# Altium schematic sheet MCU.SchDoc: MCU
size 431 x 279 mm; Organization: ORGANIZATION; Address1: ADDRESS 1; Address2: ADDRESS 2; Address3: ADDRESS 3; Address4: ADDRESS 4; Revision: -; SheetNumber: 4; SheetTotal: 8; ENG_APP_DATE: --/--/--; DSN_APP_DATE: --/--/--; CHK_APP_DATE: --/--/--
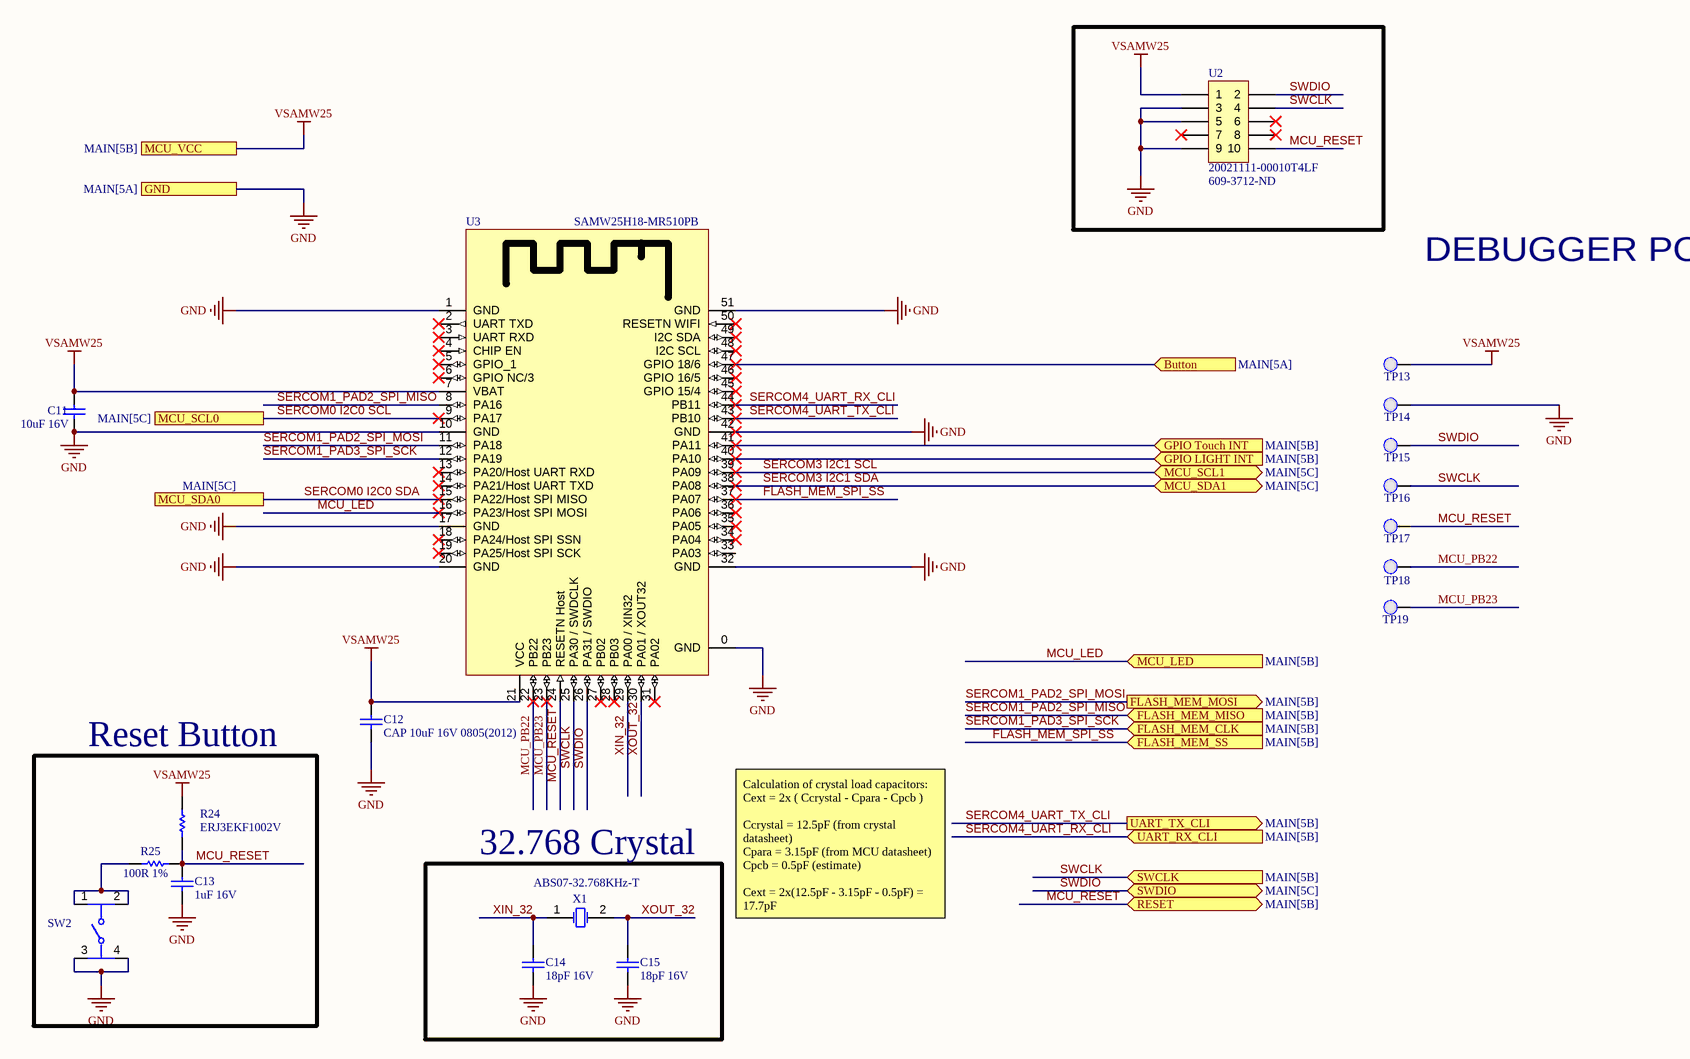
[diagram p0: MCU.SchDoc]

## Parts
C11  10uF 16V  [CAPC0805(2012)145_N]
C12  CAP 10uF 16V 0805(2012)  [CAPC0805(2012)145_N]
C13  1uF 16V  [CAPC0603(1608)100_N]
C14  18pF 16V  [CAPC0603(1608)100_N]
C15  18pF 16V  [CAPC0603(1608)100_N]
R24  ERJ3EKF1002V  [RESC1609X55X30LL15T15]
R25  100R 1%  [RESC0603(1608)_N]
SW2  PTS810 SJG 250 SMTR LFS  [FP-PTS810_SJG_250_SMTR_LF-MFG]  (value not drawn)
TP13  0.1" Pad  [PCBComponent]  (value not drawn)
TP14  0.1" Pad  [PCBComponent]  (value not drawn)
TP15  0.1" Pad  [PCBComponent]  (value not drawn)
TP16  0.1" Pad  [PCBComponent]  (value not drawn)
TP17  0.1" Pad  [PCBComponent]  (value not drawn)
TP18  0.1" Pad  [PCBComponent]  (value not drawn)
TP19  0.1" Pad  [PCBComponent]  (value not drawn)
U2  20021111-00010T4LF  Supplier Part Number 1: 609-3712-ND  [20021111-00010T4LF]
U3  SAMW25H18-MR510PB  [SAMW25H18-MR510PB]
X1  ABS07-32.768KHz-T  [ABRA-ABS07-2_V]

## Blocks framed on the sheet
Reset Button: C13 R24 R25 SW2
32.768 Crystal: C14 C15 X1

## Ports
Button (in, see MAIN[5A]), FLASH_MEM_CLK (in, see MAIN[5B]), FLASH_MEM_MISO (in, see MAIN[5B]), FLASH_MEM_MOSI (out, see MAIN[5B]), FLASH_MEM_SS (in, see MAIN[5B]), GND (see MAIN[5A]), GPIO LIGHT INT (in, see MAIN[5B]), GPIO Touch INT (in, see MAIN[5B]), MCU_LED (in, see MAIN[5B]), MCU_SCL0 (see MAIN[5C]), MCU_SCL1 (bidir, see MAIN[5C]), MCU_SDA0 (see MAIN[5C]), MCU_SDA1 (bidir, see MAIN[5C]), MCU_VCC (see MAIN[5B]), RESET (bidir, see MAIN[5B]), SWCLK (in, see MAIN[5B]), SWDIO (bidir, see MAIN[5C]), UART_RX_CLI (in, see MAIN[5B]), UART_TX_CLI (out, see MAIN[5B])

## Nets
GND: C11.1 C12.1 C13.1 C14.1 C15.1 SW2.3 SW2.4 TP14.1(PAD) U2.3 U2.5 U2.9 U3.0(GND) U3.1(GND) U3.10(GND) U3.17(GND) U3.20(GND) U3.32(GND) U3.42(GND) U3.51(GND) ; port GND
VSAMW25: C11.2 C12.2 R24.2 TP13.1(PAD) U2.1 U3.7(VBAT) U3.21(VCC) ; port MCU_VCC
Button: U3.47(GPIO_18/6) ; port Button
FLASH_MEM_SPI_SS: U3.37(PA07) ; port FLASH_MEM_SS
GPIO LIGHT INT: U3.40(PA10) ; port GPIO LIGHT INT
GPIO Touch INT: U3.41(PA11) ; port GPIO Touch INT
MCU_LED: U3.16(PA23/Host_SPI_MOSI) ; port MCU_LED
MCU_PB22: TP18.1(PAD) U3.22(PB22)
MCU_PB23: TP19.1(PAD) U3.23(PB23)
MCU_RESET: C13.2 R24.1 R25.2 TP17.1(PAD) U2.10 U3.24(RESETN_Host) ; port RESET
SERCOM0 I2C0 SCL: U3.9(PA17) ; port MCU_SCL0
SERCOM0 I2C0 SDA: U3.15(PA22/Host_SPI_MISO) ; port MCU_SDA0
SERCOM1_PAD2_SPI_MISO: U3.8(PA16) ; port FLASH_MEM_MISO
SERCOM1_PAD2_SPI_MOSI: U3.11(PA18) ; port FLASH_MEM_MOSI
SERCOM1_PAD3_SPI_SCK: U3.12(PA19) ; port FLASH_MEM_CLK
SERCOM3 I2C1 SCL: U3.39(PA09) ; port MCU_SCL1
SERCOM3 I2C1 SDA: U3.38(PA08) ; port MCU_SDA1
SERCOM4_UART_RX_CLI: U3.44(PB11) ; port UART_RX_CLI
SERCOM4_UART_TX_CLI: U3.43(PB10) ; port UART_TX_CLI
SWCLK: TP16.1(PAD) U2.4 U3.25(PA30_/_SWDCLK) ; port SWCLK
SWDIO: TP15.1(PAD) U2.2 U3.26(PA31_/_SWDIO) ; port SWDIO
XIN_32: C14.2 U3.29(PA00_/_XIN32) X1.1(X1)
XOUT_32: C15.2 U3.30(PA01_/_XOUT32) X1.2(X2)
NetR25_1: R25.1 SW2.1 SW2.2

Not connected (* = marked no-connect by the designer): U2 6* 7* 8*; U3 2(UART_TXD)* 3(UART_RXD)* 4(CHIP_EN)* 5(GPIO_1)* 6(GPIO_NC/3)* 13(PA20/Host_UART_RXD)* 14(PA21/Host_UART_TXD)* 18(PA24/Host_SPI_SSN)* 19(PA25/Host_SPI_SCK)* 27(PB02)* 28(PB03)* 31(PA02)* 33(PA03) 34(PA04)* 35(PA05)* 36(PA06)* 45(GPIO_15/4)* 46(GPIO_16/5)* 48(I2C_SCL)* 49(I2C_SDA)* 50(RESETN_WIFI)*

## Notes on the sheet
- DEBUGGER PORT
- Calculation of crystal load capacitors:
  Cext = 2x ( Ccrystal - Cpara - Cpcb )
  Ccrystal = 12.5pF (from crystal datasheet)
  Cpara = 3.15pF (from MCU datasheet)
  Cpcb = 0.5pF (estimate)
  Cext = 2x(12.5pF - 3.15pF - 0.5pF) = 17.7pF
- DWG. NO.
- REV.
- SHT.
- THIS DOCUMENT AND THE DATA DISCLOSED HEREIN OR HEREWITH IS THE PROPERTY OF ALTIUM LIMITED AND MAY BE FREELY DISTRIBUTED IN WHOLE. NO RIGHTS ARE RESERVED OR EXPRESS OR IMPLIED WARANTEE GIVEN.
- REVISION
- DESCRIPTION
- DATE
- APPROVED
- ENG:
- APPROVALS
- PROJECT
- DSN:
- CHK:
- REFERENCE DOCUMENTS
- PROJECT REVISION:
- TITLE
- DOCUMENT REVISION:
- DESIGN ITEM:
- BOM:
- FAB DWG:
- PCB DWG:
- ASSY DWG:
- SCALE:
- SIZE
- B
- CAGE CODE
- FILE NAME
- DWG NO.
- SHEET
- OF
- REV

## Library data of the parts
C11 C12 = CMP-1036-04927-1: CAP 10uF 16V ±10% 0805 (2012 Metric) Thickness 1.45mm SMD; Case-EIA: 0805; Tolerance: Â±10%; Case-Metric: 2012; Rated Voltage: 16 V; Technology: SMT; Value: 10uF; Max Thickness: 1.45 mm
C13 = CMP-1035-02736-1: CAP 1uF 16V ±5% 0603 (1608 Metric) Thickness 1mm SMD; Case-Metric: 1608; Case-EIA: 0603; Tolerance: Â±5%; Technology: SMT; Max Thickness: 1 mm; Rated Voltage: 16 V; Value: 1uF
C14 C15 = CMP-1035-00738-1: CAP 18pF 16V ±5% 0603 (1608 Metric) Thickness 1mm SMD; Tolerance: Â±5%; Case-EIA: 0603; Case-Metric: 1608; Max Thickness: 1 mm; Rated Voltage: 16 V; Value: 18pF; Technology: SMT
R24 = CMP-1012-00623-3: Chip Resistor, 10 KOhm, +/- 1%, 0.1 W, -55 to 155 degC, 0603 (1608 Metric), RoHS, Tape and Reel; Manufacturer: Panasonic; Case\/Package: 0603; Max Power Dissipation: 100mW; Resistance: 10KOhm; Temperature Coefficient: 100ppm\/degreesC; Voltage Rating (DC): 75V; Tolerance: 1%; Case Code (Imperial): 0603; Case Code (Metric): 1608; Composition: ThickFilm; Contact Plating: Tin; Datasheet URL: https://industrial.panasonic.com/cdbs/www-data/pdf/RDA0000/AOA0000C304.pdf; Datasheet Version: 02/2017; Depth: 0.8mm; Height: 0.45mm; Lead Free: LeadFree; Length: 1.6mm; Manufacturer URL: http://www.panasonic.com/; Max Operating Temperature: 155degC; Military Standard: Not; Min Operating Temperature: -55degC; Mount: SurfaceMount; Mounting Technology: SurfaceMount; Number of Pins: 2; Number of Terminations: 2; Package Description: 2-Pin Surface Mount Device, Body 1.6 x 0.85 mm; Package Quantity: 1; Package Reference: 603; Packaging: TapeandReel; Power Rating: 100mW; Radiation Hardening: No; REACH SVHC: NoSVHC; RoHSCompliant: true; Termination: SMD/SMT; Voltage Rating: 75V; Width: 0.031inch
R25 = CMP-1012-00397-1: 100R 0.1W 1% 0603 (1608 Metric)  SMD; Value: 100.00 Ohm; Case-EIA: 0603; Case-Metric: 1608; Technology: SMT; Tolerance: 1 %; Power: 0.1 W
SW2 = CMP-10040-000011-1: SWITCH TACTILE SPST-NO 0.05A 16V; Manufacturer: C&K Components; Electromechanical Life: 100000Cycles; Contact Resistance: 500mΩ; Operating Force: 400gf; Current Rating: 50mA; Voltage Rating Dc: 16V; Device Class L2: Switches; Device Class L1: Electromechanical; ComponentLink2URL: https://www.ckswitches.com/media/1476/pts810.pdf; Digikey Description: SWITCH TACTILE SPST-NO 0.05A 16V; RoHS: TRUE; Temperature Range Low: -40°C; Temperature Range High: +85°C; Automotive: No; Category: Switch; ComponentLink2Description: Datasheet; Device Class L3: Tactile Switches; Mouser Description: Switch Tactile N.O. SPST Button J-Bend 0.05A 16VDC 100000Cycles 3.92N SMD T/R; Throw Configuration: SPST-NO; Package: PTS810 SJG 250 SMTR LFS; Height: 2.7mm; Octopart: https://octopart.com/pts810sjg250smtrlfs-c%26k+components-29380277; Manufacturer Part Number: PTS810 SJG 250 SMTR LFS; Temperature: -40°C to +85°C; Lead Free: Yes
TP13-TP19 = 0.1" Pad-A.4
U2 = 20021111-00010T4LF: CONN HEADER 10POS UNSHD VERT T/H; Manufacturer: Amphenol / FCI; Stack Height: 2.5 mm; Number of Positions / Contacts: 10; Brand: FCI; Pitch: 1.27 mm; Mounting Angle: Vertical; Current Rating: 10 A; Mating Post Length: 3.05 mm; Voltage Rating: 125 V; Manufacturer Part Number: 20021111-00010T4LF; Mounting Style: Through Hole; Product Category: Headers & Wire Housings; RoHS: Details; Series: Minitek; Product Type: Headers; Type: Unshrouded; Number of Positions: 10; Number of Rows: 2; Contact Plating: Gold; Housing Material: Plastic; Termination Style: Through Hole; Contact Material: Nickel; Packaging: Tube; Factory Pack Quantity: 93; Termination Post Length: 2.3 mm; ComponentLink1URL: https://datasheet.ciiva.com/1433/1079612-1433267.pdf; ComponentLink1Description: https://datasheet.ciiva.com/1433/1079612-1433267.pdf; ComponentLink2URL: https://datasheet.ciiva.com/409/20021111-409158.pdf; ComponentLink2Description: https://datasheet.ciiva.com/409/20021111-409158.pdf; ComponentLink3URL: https://datasheet.ciiva.com/5131/20021111-5131386.pdf; ComponentLink3Description: https://datasheet.ciiva.com/5131/20021111-5131386.pdf; ComponentLink4URL: https://datasheet.ciiva.com/9465/20021111-9465402.pdf; ComponentLink4Description: https://datasheet.ciiva.com/9465/20021111-9465402.pdf; Supplier 1: Digi-Key
U3 = SAMW25H18-MR510PB: RF TXRX MODULE WIFI TRACE ANT; Manufacturer: Atmel; Manufacturer Part Number: ATSAMW25H18-MR510PB; Protocol: 802.11b/g/n; Frequency: 2.4GHz; Data Rate: 65Mbps; Power - Output: 17dBm; Sensitivity: -95.5dBm; Serial Interfaces: SPI, UART; Antenna Type: Integrated, Trace; Memory Size: 256kB Flash, 32kB SRAM; Voltage - Supply: 2.7 V ~ 4.2 V; Category: RF/IF and RFID; Family: RF Transceiver Modules; Series: Xplained Pro; Packaging: Tray; RF Family/Standard: WiFi; Modulation: -; Current - Receiving: -; Current - Transmitting: -; Mounting Type: Surface Mount; Operating Temperature: -40°C ~ 85°C; Package / Case: Module; ComponentLink1URL: http://www.atmel.com/devices/ATSAMW25.aspx; ComponentLink1Description: http://www.atmel.com/devices/ATSAMW25.aspx; ComponentLink2URL: http://www.farnell.com/datasheets/1965115.pdf; ComponentLink2Description: http://www.farnell.com/datasheets/1965115.pdf; Supplier 1: Digikey; Stock 1: 120; Pricing 1: 1=19.14 (USD); Supplier Part Number 1: ATSAMW25H18-MR510PB-ND
X1 = CMP-0447-00001-2: Crystal, 32.768 kHz, 12.5 pF, -40 to 85 degC, SMD Low Profile 3.2 x 1.5 x 0.9 mm, Tape and Reel; Manufacturer: Abracon; Q Value (Type): 30000; Operation Mode: Flexural Mode (Tuning Fork); Shunt Capacitance (C0): 0.9 to 1.2 pF; Load Capacitance (CL): 12.5 pF; Frequency Tolerance @+25degC: +/- 20 ppm; Drive Level (Type): 0.1 uW; Equivalent Series Resistance (R1): 70 Kohm; Insulation Resistance (Min): 500 Mohm; ComponentLink3URL: http://www.abracon.com/Resonators/ABS07.pdf; PackageDescription: 2-Pin Hand Drawn, Body 3.2x1.5mm, Pitch 2.5mm; Operating Temperature: -40 to 85 degC; ComponentLink2URL: http://www.abracon.com/Resonators/ABS07.pdf; PackageReference: ABS07-2; ComponentLink3Description: Package Specification; ComponentLink1Description: Manufacturer URL; DatasheetVersion: 04.03.13; Mounting Technology: Surface Mount; ComponentLink2Description: Datasheet; ComponentLink1URL: http://www.abracon.com/; PartNumber: ABS07-32.768KHz-T; Packing: Tape and Reel; Frequency: 32.768 kHz